# Altium schematic sheet 下程序新版2.1.1.SchDoc
size A2
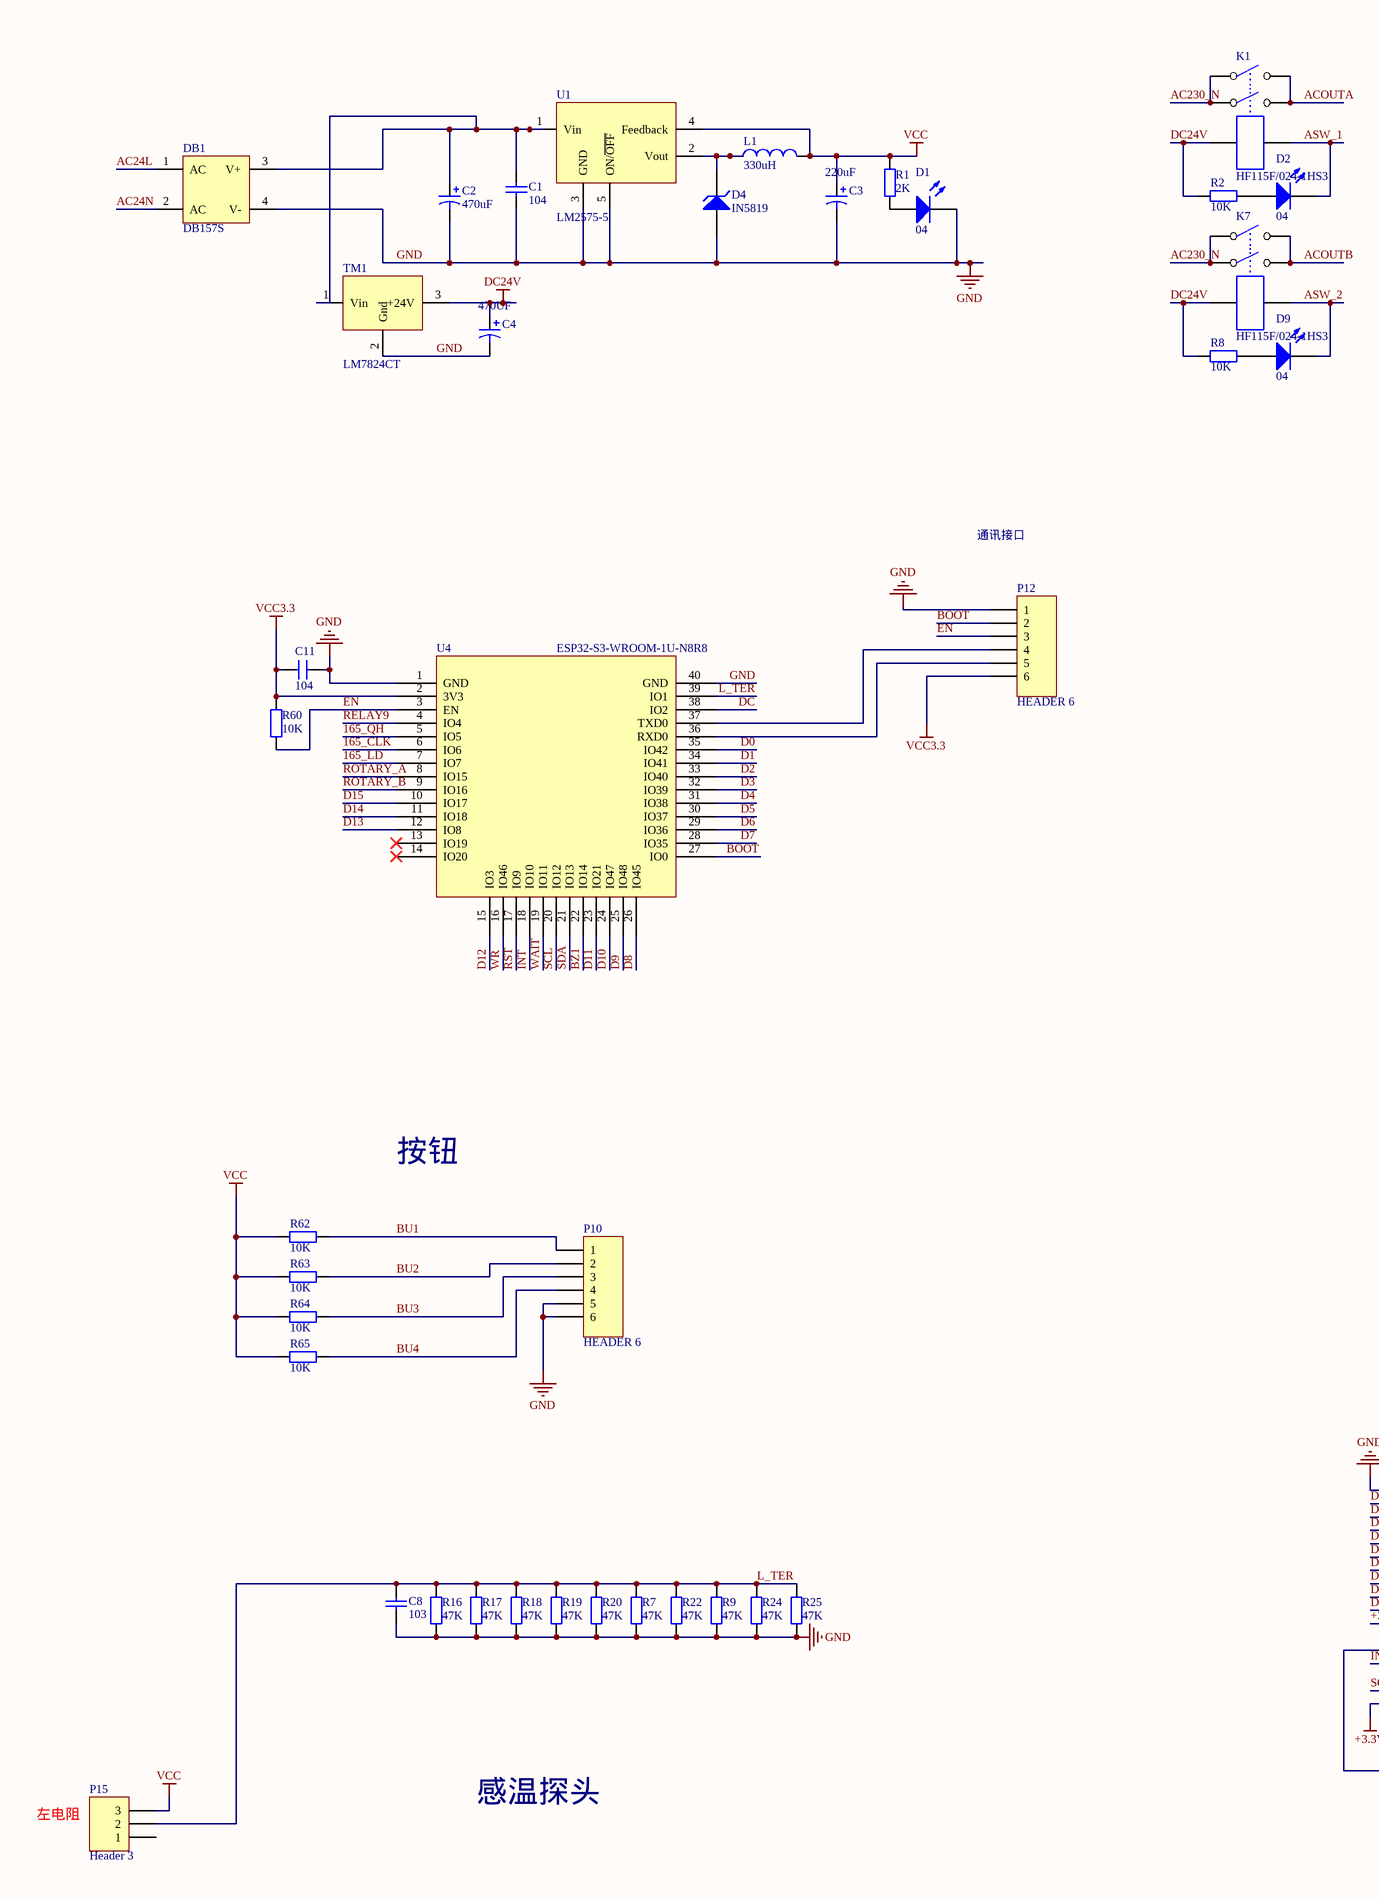
[diagram p0: 下程序新版2.1.1.SchDoc, left]
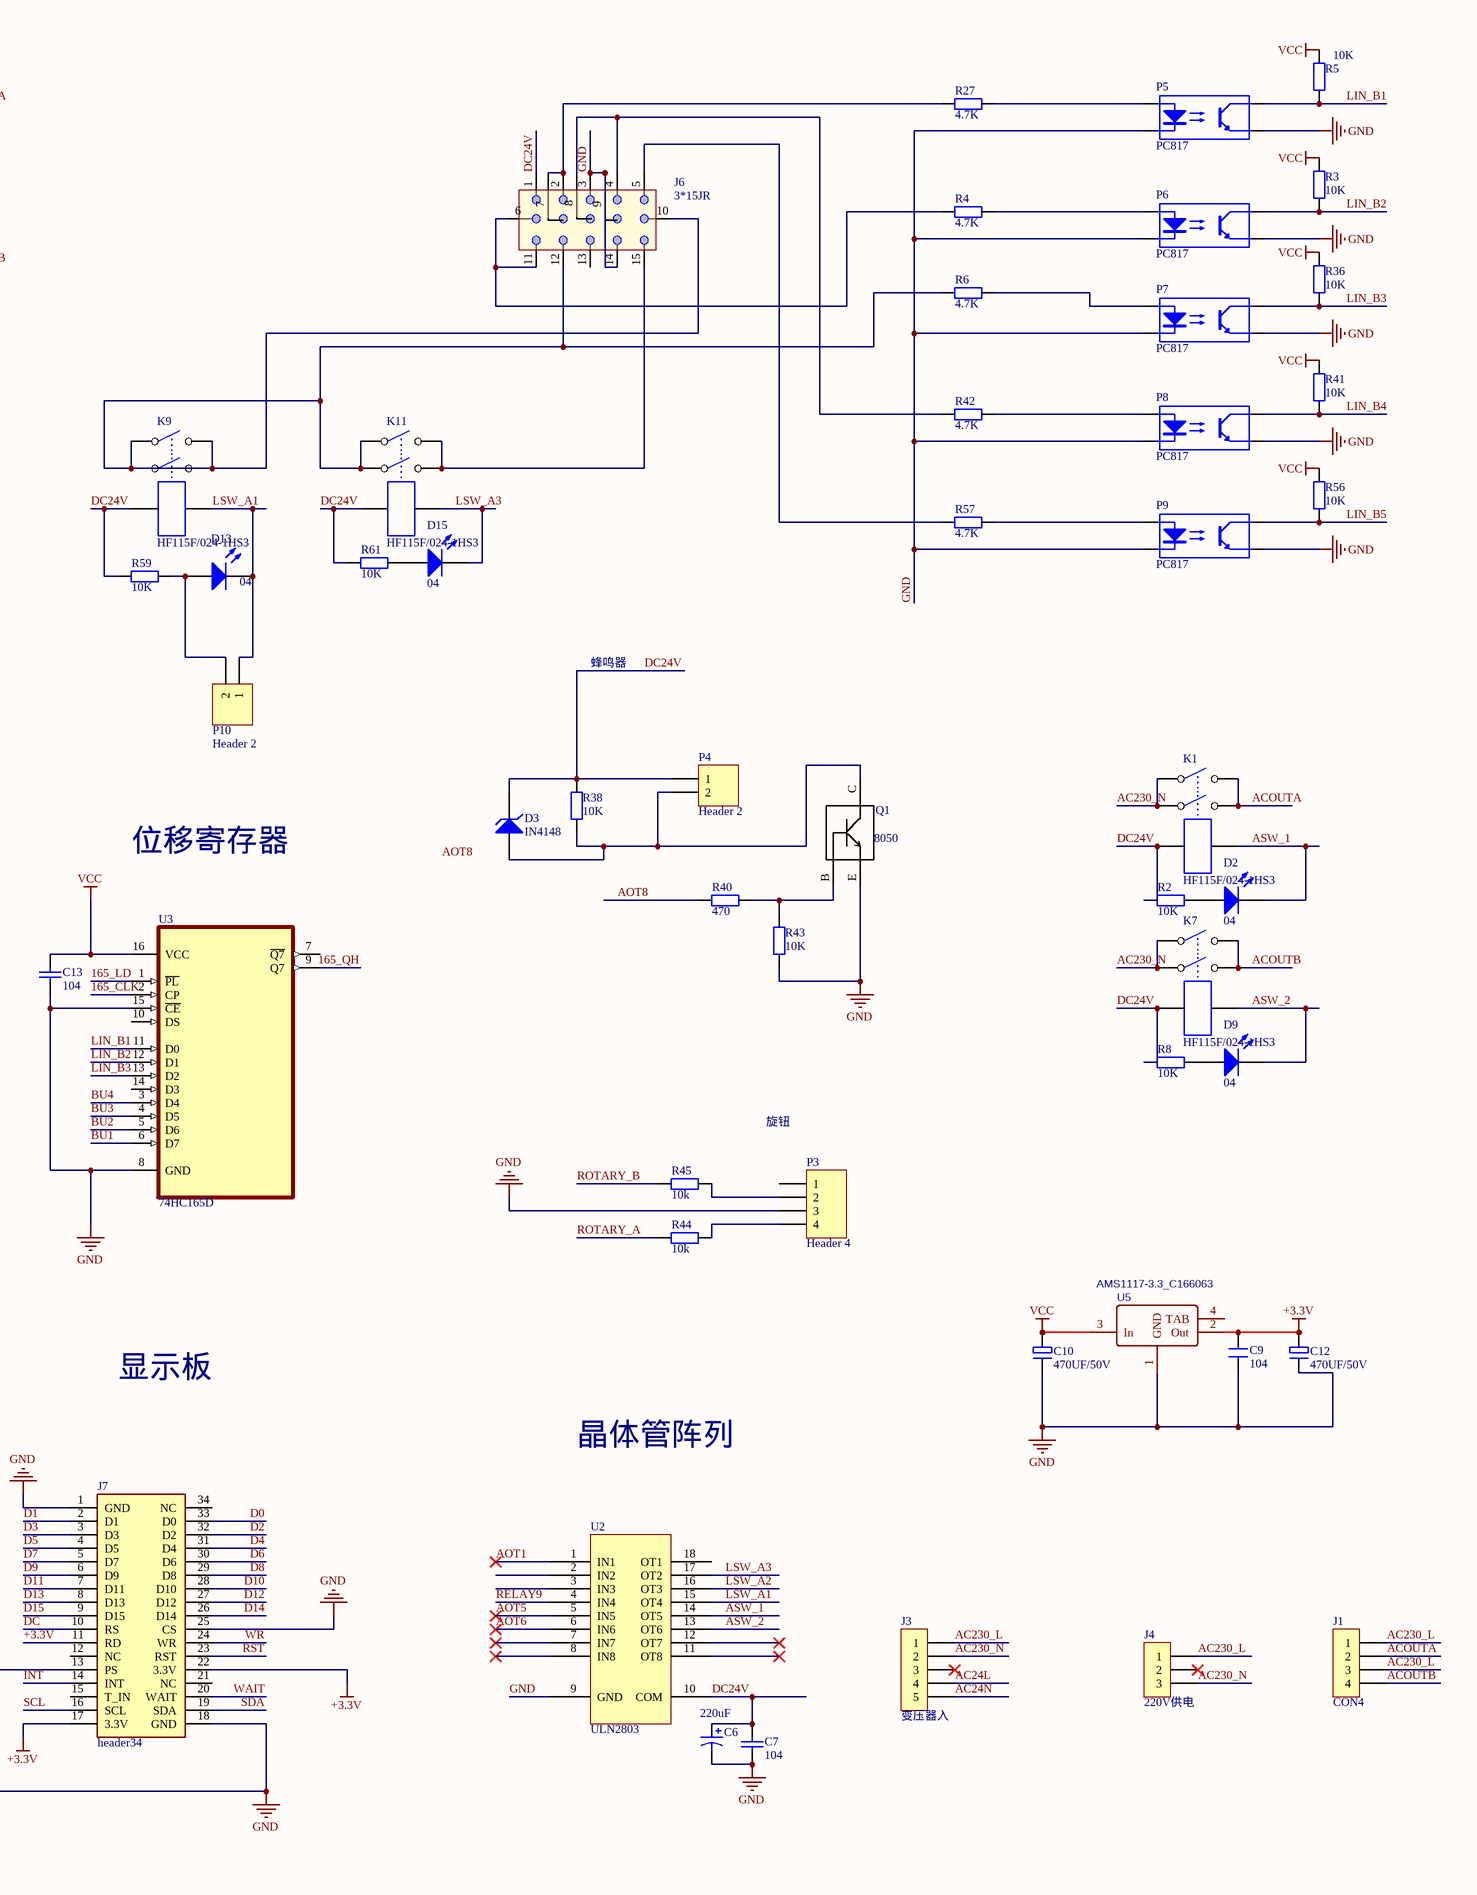
[diagram p1: 下程序新版2.1.1.SchDoc, right]

## Parts
(Parts that share a designator on the sheet are numbered #1, #2 ... from top to bottom, then left to right.)
C1  104  [0805]
C2  value 470uF  [CD9]  (hidden comment: 470UF/50V)
C3  220uF  [CD9]
C4  470UF  [CD9]
C6  220uF  [CD9]
C7  104  [0805]
C8  103  [0805]
C9  104  [0805]
C10  470UF/50V  [CD9]
C11  104  [0805]
C12  470UF/50V  [CD9]
C13  104  [0805]
D1  04  [LED-T]
D2#1  04  [LED-T]
D2#2  04  [LED-T]
D3  IN4148  [DO-214AC]
D4  IN5819  [DO-214AC]
D9#1  04  [LED-T]
D9#2  04  [LED-T]
D13  04  [LED-T]
D15  04  [LED-T]
DB1  DB157S  [LC-GBU]
J1  CON4  [4PIN-6.3]
J3  变压器入  [5PIN-6.3]
J4  220V供电  [3PIN-6.3]
J6  3*15JR  [3*5PIN-6.3]
J7  header34  [SAMTEC_HTSW-110-24-TM-D]
K1#1  HF115F/024-1HS3  [HF115FA]
K1#2  HF115F/024-1HS3  [HF115FA]
K7#1  HF115F/024-1HS3  [HF115FA]
K7#2  HF115F/024-1HS3  [HF115FA]
K9  HF115F/024-1HS3  [HF115FA]
K11  HF115F/024-1HS3  [HF115FA]
L1  330uH  [SMD331]
P3  Header 4  [4PIN 2.54]
P4  Header 2  [2PIN 3.96]
P5  PC817  [LC-SMD-4]
P6  PC817  [LC-SMD-4]
P7  PC817  [LC-SMD-4]
P8  PC817  [LC-SMD-4]
P9  PC817  [LC-SMD-4]
P10#1  Header 2  [2PIN 3.96]
P10#2  HEADER 6
P12  HEADER 6
P15  Header 3  [3PIN 3.96]
Q1  8050  [SOT-23 - duplicate]
R1  2K  [0805]
R2#1  10k  [0805]
R2#2  10k  [0805]
R3  10k  [0805]
R4  4.7K  [0805]
R5  10k  [0805]
R6  4.7K  [0805]
R7  47K  [0805]
R8#1  10k  [0805]
R8#2  10k  [0805]
R9  47K  [0805]
R16  47K  [0805]
R17  47K  [0805]
R18  47K  [0805]
R19  47K  [0805]
R20  47K  [0805]
R22  47K  [0805]
R24  47K  [0805]
R25  47K  [0805]
R27  4.7K  [0805]
R36  10k  [0805]
R38  10K  [0805]
R40  470  [0805]
R41  10k  [0805]
R42  4.7K  [0805]
R43  10K  [0805]
R44  10k  [0805]
R45  10k  [0805]
R56  10k  [0805]
R57  4.7K  [0805]
R59  10k  [0805]
R60  10K  [0805]
R61  10k  [0805]
R62  10K  [0805]
R63  10K  [0805]
R64  10K  [0805]
R65  10K  [0805]
TM1  LM7824CT  [TO-220]
U1  LM2575-5  [D2PAK]
U2  ULN2803  [SOP-18_300mil]
U3  74HC165D  [SOIC127P600X175-16N]
U4  ESP32-S3-WROOM-1U-N8R8  [ESP32-S3-WROOM-1U]
U5  AMS1117-3.3_C166063  [SOT-223_L6.7-W3.5-P2.30-BR]

## Nets
+3.3V: C9.1 C12.1 J7.11(RD) J7.17(3.3V) J7.22(3.3V) U5.2(Out)
DC24V: C4.1 C6.1 C7.2 D3.2(K) J6.1 K1#1.5 K1#2.5 K7#1.5 K7#2.5 K9.5 K11.5 P4.1 R2#1.2 R2#2.2 R8#1.2 R8#2.2 R38.2 R59.2 R61.2 TM1.3(+24V) U2.10(COM)
GND: C1.1 C2.2 C3.2 C4.2 C6.2 C7.1 C8.1 C9.2 C10.2 C11.2 C12.2 C13.1 D1.2(K) D4.1(A) DB1.4(V-) J6.3 J6.9 J6.14 J7.1(GND) J7.13(PS) J7.18(GND) J7.25(CS) P3.3 P5.2(LED_Cathode) P5.3(Emitter) P6.2(LED_Cathode) P6.3(Emitter) P7.2(LED_Cathode) P7.3(Emitter) P8.2(LED_Cathode) P8.3(Emitter) P9.2(LED_Cathode) P9.3(Emitter) P10#2.5 P10#2.6 P12.1 Q1.E R7.1 R9.1 R16.1 R17.1 R18.1 R19.1 R20.1 R22.1 R24.1 R25.1 R43.1 TM1.2(Gnd) U1.3(GND) U1.5(ON/~{OFF}) U2.9(GND) U3.8(GND) U3.15(~{CE}) U4.1(GND) U4.40(GND) U5.1(GND)
VCC: C3.1 C10.1 C13.2 L1.2 P15.3 R1.2 R3.2 R5.2 R36.2 R41.2 R56.2 R62.2 R63.2 R64.2 R65.2 U1.4(Feedback) U3.16(VCC) U5.3(In)
VCC3.3: C11.1 P12.6 R60.1 U4.2(3V3)
165_CLK: U3.2(CP) U4.6(IO6)
165_LD: U3.1(~{PL}) U4.7(IO7)
165_QH: U3.9(Q7) U4.5(IO5)
AC24L: DB1.1(AC) J3.4
AC24N: DB1.2(AC) J3.5
AC230_L: J1.1 J1.3 J3.1 J4.1
AC230_N: J3.2 J4.3 K1#1.1 K1#1.3 K1#2.1 K1#2.3 K7#1.1 K7#1.3 K7#2.1 K7#2.3
ACOUTA: J1.2 K1#1.2 K1#1.4 K1#2.2 K1#2.4
ACOUTB: J1.4 K7#1.2 K7#1.4 K7#2.2 K7#2.4
AOT1: U2.1(IN1)
AOT5: U2.5(IN5)
AOT6: U2.6(IN6)
AOT8: R40.1
ASW_1: D2#1.2(K) D2#2.2(K) K1#1.6 K1#2.6 U2.14(OT5)
ASW_2: D9#1.2(K) D9#2.2(K) K7#1.6 K7#2.6 U2.13(OT6)
BOOT: P12.2 U4.27(IO0)
BU1: P10#2.1 R62.1 U3.6(D7)
BU2: P10#2.2 R63.1 U3.5(D6)
BU3: P10#2.3 R64.1 U3.4(D5)
BU4: P10#2.4 R65.1 U3.3(D4)
BZ1: U4.22(IO14)
D0: J7.33(D0) U4.35(IO42)
D1: J7.2(D1) U4.34(IO41)
D2: J7.32(D2) U4.33(IO40)
D3: J7.3(D3) U4.32(IO39)
D4: J7.31(D4) U4.31(IO38)
D5: J7.4(D5) U4.30(IO37)
D6: J7.30(D6) U4.29(IO36)
D7: J7.5(D7) U4.28(IO35)
D8: J7.29(D8) U4.26(IO45)
D9: J7.6(D9) U4.25(IO48)
D10: J7.28(D10) U4.24(IO47)
D11: J7.7(D11) U4.23(IO21)
D12: J7.27(D12) U4.15(IO3)
D13: J7.8(D13) U4.12(IO8)
D14: J7.26(D14) U4.11(IO18)
D15: J7.9(D15) U4.10(IO17)
DC: J7.10(RS) U4.38(IO2)
EN: P12.3 R60.2 U4.3(EN)
INT: J7.14(INT) U4.18(IO10)
L_TER: C8.2 P15.2 R7.2 R9.2 R16.2 R17.2 R18.2 R19.2 R20.2 R22.2 R24.2 R25.2 U4.39(IO1)
LIN_B1: P5.4(Collector) R5.1 U3.11(D0)
LIN_B2: P6.4(Collector) R3.1 U3.12(D1)
LIN_B3: P7.4(Collector) R36.1 U3.13(D2)
LIN_B4: P8.4(Collector) R41.1
LIN_B5: P9.4(Collector) R56.1
LSW_A1: D13.2(K) K9.6 P10#1.1 U2.15(OT4)
LSW_A2: U2.16(OT3)
LSW_A3: D15.2(K) K11.6 U2.17(OT2)
RELAY9: U2.4(IN4) U4.4(IO4)
ROTARY_A: R44.1 U4.8(IO15)
ROTARY_B: R45.1 U4.9(IO16)
RST: J7.23(RST) U4.17(IO9)
SCL: J7.16(SCL) U4.20(IO12)
SDA: J7.19(SDA) U4.21(IO13)
WAIT: J7.20(WAIT) U4.19(IO11)
WR: J7.24(WR) U4.16(IO46)
NetC1_2: C1.2 C2.1 DB1.3(V+) TM1.1(Vin) U1.1(Vin)
NetD1_1: D1.1(A) R1.1
NetD2#1_1: D2#1.1(A) R2#1.1
NetD2#2_1: D2#2.1(A) R2#2.1
NetD3_1: D3.1(A) P4.2 Q1.C R38.1
NetD4_2: D4.2(K) L1.1 U1.2(Vout)
NetD9#1_1: D9#1.1(A) R8#1.1
NetD9#2_1: D9#2.1(A) R8#2.1
NetD13_1: D13.1(A) P10#1.2 R59.1
NetD15_1: D15.1(A) R61.1
NetJ6_2: J6.2 J6.7 R27.1
NetJ6_4: J6.4 J6.8 R42.1
NetJ6_5: J6.5 R57.1
NetJ6_6: J6.6 J6.11 R4.1
NetJ6_10: J6.10 J6.12 K9.1 K9.2 K9.3 K9.4 K11.1 K11.3 R6.1
NetJ6_15: J6.15 K11.2 K11.4
NetP3_2: P3.2 R45.2
NetP3_4: P3.4 R44.2
NetP5_1: P5.1(LED_Anode) R27.2
NetP6_1: P6.1(LED_Anode) R4.2
NetP7_1: P7.1(LED_Anode) R6.2
NetP8_1: P8.1(LED_Anode) R42.2
NetP9_1: P9.1(LED_Anode) R57.2
NetP12_4: P12.4 U4.37(TXD0)
NetP12_5: P12.5 U4.36(RXD0)
NetQ1_B: Q1.B R40.2 R43.2

Not connected (* = marked no-connect by the designer): J3 3*; J4 2*; J6 13; J7 12(NC) 15(T_IN) 21(NC) 34(NC); P3 1; P15 1; U2 2(IN2) 3(IN3) 7(IN7)* 8(IN8)* 11(OT8)* 12(OT7)* 18(OT1); U3 7(~{Q7}) 10(DS) 14(D3); U4 13(IO19)* 14(IO20)*; U5 4(TAB)

## Notes on the sheet
- 通讯接口
- 蜂鸣器
- 位移寄存器
- 旋钮
- 按钮
- 显示板
- 晶体管阵列
- 左电阻
- 感温探头
- Labels drawn without touching a wire or pin: AOT8
- Title
- Size:
- Date:
- File:
- A2
- Number:
- Time:
- Revision:
- Sheet
- of

## Library data of the parts
C1 C7 C8 C13 = Cap: Capacitor; Published: 8-Jun-2000; LatestRevisionDate: 17-Jul-2002; LatestRevisionNote: Re-released for DXP Platform.; PackageReference: RAD-0.3; Publisher: Altium Limited
  C1 C7 C13: Value: 104
  C8: Value: 103
C2 C4 = Cap Pol1: Polarized Capacitor (Radial); Published: 8-Jun-2000; LatestRevisionDate: 17-Jul-2002; LatestRevisionNote: Re-released for DXP Platform.; PackageReference: RB7.6-15; Publisher: Altium Limited
  C4: Value: 470uF
C3 C6 = Cap Pol1: Polarized Capacitor (Radial); Value: 470uF; Published: 8-Jun-2000; LatestRevisionDate: 17-Jul-2002; LatestRevisionNote: Re-released for DXP Platform.; PackageReference: RB7.6-15; Publisher: Altium Limited
C9 C11 = CAP
C10 C12 = ECAP
D1 D2#1 D2#2 D9#1 D9#2 D13 D15 = LED0: Typical INFRARED GaAs LED; Published: 8-Jun-2000; LatestRevisionDate: 08-Jul-2005; LatestRevisionNote: Mech Layer 1 removed.; PackageReference: LED-0; Publisher: Altium Limited; PackageDescription: LED; 2 Leads
D3 D4 = D Zener: Zener Diode; Published: 8-Jun-2000; LatestRevisionDate: 17-Jul-2002; LatestRevisionNote: Re-released for DXP Platform.; PackageReference: DIODE-0.7; Publisher: Altium Limited
DB1 = BRIDGE2
J1 = CON4: Connector
J3 = CON5: Connector
J4 = CON3: Connector
J6 = Component_1
J7 = header34: HEADER, 32 CONTACTS, 2 ROWS, THROUGH HOLE, 2.54 MM; Connector Systems:Board-to-Board; Pitch Spacing:2.54mm; No. of Rows:2Rows; No. of Contacts:20Contacts; Contact Termination Type:Through Hole; Product Range:HTSW Series RoHS Compliant: Yes; MF: Samtec; MP: HTSW11024TMD; Purchase-URL: https://pricing.snapeda.com/search/part/HTSW11024TMD/?ref=eda; Check_prices: https://www.snapeda.com/parts/HTSW11024TMD/Samtec/view-part/?ref=eda; Value: *; Package: None; Price: None; Availability: In Stock; SnapEDA_Link: https://www.snapeda.com/parts/HTSW11024TMD/Samtec/view-part/?ref=snap
K1#1 K1#2 K7#1 K7#2 K9 K11 = RELAY-DPST
L1 = Inductor: Code_IEC: 1005; Published: 8-Jun-2000; LatestRevisionDate: 29-May-2009; LatestRevisionNote: IPC-7351 Footprint Added.; PackageReference: 0402-A; Publisher: Altium Limited; PackageDescription: Chip Inductor; Code_JEITA: 0402
P3 = Header 4: Header, 4-Pin; LatestRevisionDate: 17-Jul-2002; LatestRevisionNote: Re-released for DXP Platform.; Publisher: Altium Limited
P4 P10#1 = Header 2: Header, 2-Pin; LatestRevisionDate: 17-Jul-2002; LatestRevisionNote: Re-released for DXP Platform.; Publisher: Altium Limited
P5-P9 = P521
P15 = Header 3: Header, 3-Pin; LatestRevisionDate: 17-Jul-2002; LatestRevisionNote: Re-released for DXP Platform.; Publisher: Altium Limited
Q1 = BC817-8050
R1 R2#1 R2#2 R3-R7 R8#1 R8#2 R9 R16-R20 R22 R24 R25 R27 R36 R41 R42 R56 R57 R59-R61 = Res2: Resistor; Published: 8-Jun-2000; LatestRevisionDate: 17-Jul-2002; LatestRevisionNote: Re-released for DXP Platform.; PackageReference: AXIAL-0.4; Publisher: Altium Limited
  R1: Value: 2K
  R2#1 R2#2 R3 R5 R8#1 R8#2 R36 R41 R56 R59 R61: Value: 10K
  R4 R6 R27 R42 R57: Value: 4.7K
  R7 R9 R16-R20 R22 R24 R25: Value: 47K
R38 R40 R43-R45 R62-R65 = Res2: Resistor; Value: RT0603BRD071KL YAGEO; Published: 8-Jun-2000; LatestRevisionDate: 17-Jul-2002; LatestRevisionNote: Re-released for DXP Platform.; PackageReference: AXIAL-0.4; Publisher: Altium Limited
U1 = LM2575
U3 = 74HC165D: Shift Shift Register 1 Element 8 Bit 16-SOIC; MF: Toshiba Semiconductor; MP: 74HC165D; Package: SOIC-16 Nexperia; Availability: Unavailable; Price: None; SnapEDA_Link: https://www.snapeda.com/parts/74HC165D/Toshiba%20Semiconductor%20and%20Storage/view-part/2523929/?ref=snap; Value: *
U4 = ESP32-S3-WROOM-1U
U5 = AMS1117-1.5_C166063: BOM_Manufacturer: SK; Contributor: LCSC; SMT Type: Extend; BOM_Supplier: LCSC; BOM_Supplier Part: C166063; BOM_Manufacturer Part: AMS1117-1.5; BOM_LCSC Assembly: Yes; spicePre: U